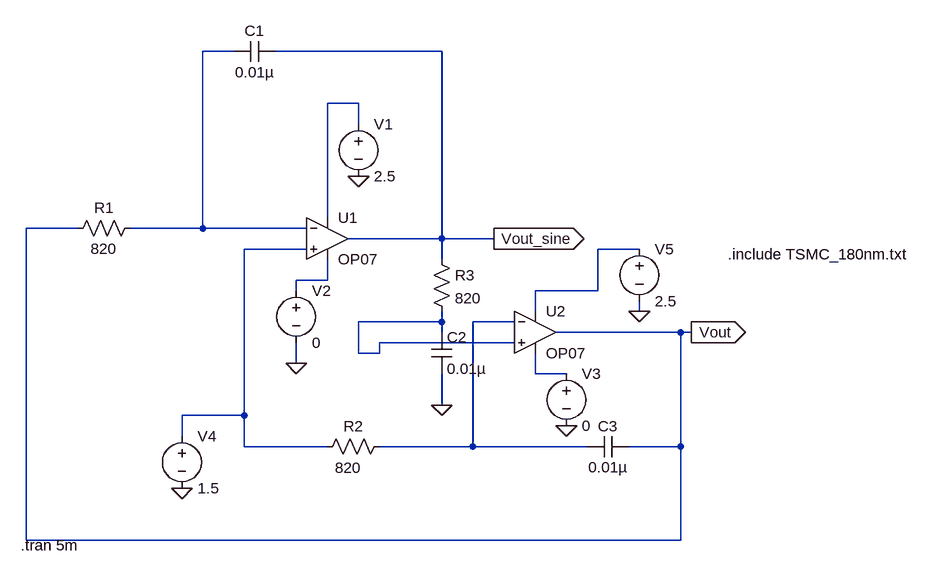
[diagram p0: schematic OSCILLATOR_not_100Hkz.asc]
OSCILLATOR_not_100Hkz.asc, the LTspice schematic file:
Version 4
SHEET 1 880 680
WIRE -224 -192 -272 -192
WIRE 96 -192 -160 -192
WIRE -32 -112 -80 -112
WIRE -32 -80 -32 -112
WIRE -80 64 -80 -112
WIRE -464 80 -544 80
WIRE -272 80 -272 -192
WIRE -272 80 -384 80
WIRE -112 80 -272 80
WIRE 96 96 96 -192
WIRE 96 96 -48 96
WIRE 176 96 96 96
WIRE -112 112 -208 112
WIRE 400 112 336 112
WIRE 96 128 96 96
WIRE -80 160 -80 128
WIRE -80 160 -128 160
WIRE -128 176 -128 160
WIRE 336 176 336 112
WIRE 336 176 240 176
WIRE 240 208 240 176
WIRE 400 208 400 192
WIRE 96 224 96 208
WIRE 96 224 -32 224
WIRE 208 224 144 224
WIRE 96 240 96 224
WIRE 464 240 272 240
WIRE 480 240 464 240
WIRE 208 256 0 256
WIRE -32 272 -32 224
WIRE 0 272 0 256
WIRE 0 272 -32 272
WIRE -128 288 -128 256
WIRE 240 304 240 272
WIRE 288 304 240 304
WIRE 96 352 96 304
WIRE -208 368 -208 112
WIRE -208 368 -304 368
WIRE -304 400 -304 368
WIRE -208 416 -208 368
WIRE -80 416 -208 416
WIRE 144 416 144 224
WIRE 144 416 0 416
WIRE 320 416 144 416
WIRE 464 416 464 240
WIRE 464 416 384 416
WIRE -544 560 -544 80
WIRE 464 560 464 416
WIRE 464 560 -544 560
FLAG -32 0 0
FLAG 96 352 0
FLAG 480 240 Vout
IOPIN 480 240 Out
FLAG 176 96 Vout_sine
IOPIN 176 96 Out
FLAG -128 288 0
FLAG 288 384 0
FLAG -304 480 0
FLAG 400 208 0
SYMBOL res -368 64 R90
WINDOW 0 0 56 VBottom 2
WINDOW 3 32 56 VTop 2
SYMATTR InstName R1
SYMATTR Value 820
SYMBOL res 16 400 R90
WINDOW 0 0 56 VBottom 2
WINDOW 3 33 64 VTop 2
SYMATTR InstName R2
SYMATTR Value 820
SYMBOL voltage -32 -96 R0
WINDOW 123 0 0 Left 0
WINDOW 39 0 0 Left 0
SYMATTR InstName V1
SYMATTR Value 2.5
SYMBOL OpAmps\\OP07 -80 32 R0
SYMATTR InstName U1
SYMBOL cap -160 -208 R90
WINDOW 0 0 32 VBottom 2
WINDOW 3 32 32 VTop 2
SYMATTR InstName C1
SYMATTR Value 0.01µ
SYMBOL OpAmps\\OP07 240 176 R0
SYMATTR InstName U2
SYMBOL res 80 112 R0
SYMATTR InstName R3
SYMATTR Value 820
SYMBOL cap 80 240 R0
SYMATTR InstName C2
SYMATTR Value 0.01µ
SYMBOL cap 384 400 R90
WINDOW 0 0 32 VBottom 2
WINDOW 3 32 32 VTop 2
SYMATTR InstName C3
SYMATTR Value 0.01µ
SYMBOL voltage -128 160 R0
WINDOW 123 0 0 Left 0
WINDOW 39 0 0 Left 0
SYMATTR InstName V2
SYMATTR Value 0
SYMBOL voltage 288 288 R0
WINDOW 123 0 0 Left 0
WINDOW 39 0 0 Left 0
SYMATTR InstName V3
SYMATTR Value 0
SYMBOL voltage -304 384 R0
WINDOW 123 0 0 Left 0
WINDOW 39 0 0 Left 0
SYMATTR InstName V4
SYMATTR Value 1.5
SYMBOL voltage 400 96 R0
WINDOW 123 0 0 Left 0
WINDOW 39 0 0 Left 0
SYMATTR InstName V5
SYMATTR Value 2.5
TEXT -552 568 Left 2 !.tran 5m
TEXT 536 120 Left 2 !.include TSMC_180nm.txt

The netlist it stands for:
* OSCILLATOR_not_100Hkz.asc
R1 N001 Vout 820
R2 N007 N003 820
V1 N002 0 2.5
XU1 N003 N001 N002 N005 Vout_sine LT1001  ; OP07, pins In+ In- V+ V- OUT
C1 Vout_sine N001 0.01µ
XU2 N006 N007 N004 N008 Vout LT1001  ; OP07, pins In+ In- V+ V- OUT
R3 Vout_sine N006 820
C2 N006 0 0.01µ
C3 Vout N007 0.01µ
V2 N005 0 0
V3 N008 0 0
V4 N003 0 1.5
V5 N004 0 2.5
.tran 5m
.include TSMC_180nm.txt
.lib LTC.lib
.backanno
.end